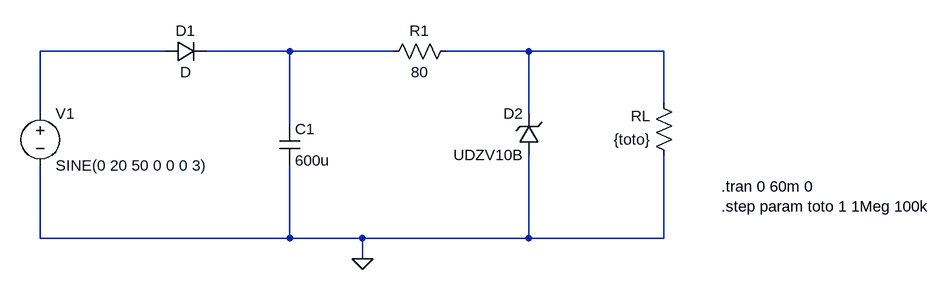
[diagram p0: schematic stabbilisateur_tension_zener.asc]
stabbilisateur_tension_zener.asc, the LTspice schematic file:
Version 4
SHEET 1 1332 680
WIRE 112 208 -80 208
WIRE 304 208 176 208
WIRE 464 208 304 208
WIRE 672 208 544 208
WIRE 880 208 672 208
WIRE 880 288 880 208
WIRE -80 304 -80 208
WIRE 672 304 672 208
WIRE 304 320 304 208
WIRE -80 496 -80 384
WIRE 304 496 304 384
WIRE 304 496 -80 496
WIRE 416 496 304 496
WIRE 672 496 672 368
WIRE 672 496 416 496
WIRE 880 496 880 368
WIRE 880 496 672 496
WIRE 416 528 416 496
FLAG 416 528 0
SYMBOL voltage -80 288 R0
SYMATTR InstName V1
SYMATTR Value SINE(0 20 50 0 0 0 3)
SYMBOL diode 112 224 R270
WINDOW 0 32 32 VTop 2
WINDOW 3 0 32 VBottom 2
SYMATTR InstName D1
SYMBOL res 560 192 R90
WINDOW 0 0 56 VBottom 2
WINDOW 3 32 56 VTop 2
SYMATTR InstName R1
SYMATTR Value 80
SYMBOL res 896 384 R180
WINDOW 0 36 76 Left 2
WINDOW 3 36 40 Left 2
SYMATTR InstName RL
SYMATTR Value {toto}
SYMBOL cap 288 320 R0
SYMATTR InstName C1
SYMATTR Value 600u
SYMBOL zener 688 368 R180
WINDOW 0 24 64 Left 2
WINDOW 3 24 0 Left 2
SYMATTR InstName D2
SYMATTR Value UDZV10B
TEXT 968 416 Left 2 !.tran 0 60m 0\n.step param toto 1 1Meg 100k

The netlist it stands for:
* stabbilisateur_tension_zener.asc
V1 N001 0 SINE(0 20 50 0 0 0 3)
D1 N001 N002 D
R1 N003 N002 80
RL 0 N003 {toto}
C1 N002 0 600u
D2 0 N003 UDZV10B
.model D D
.lib standard.dio
.tran 0 60m 0
.step param toto 1 1Meg 100k
.backanno
.end